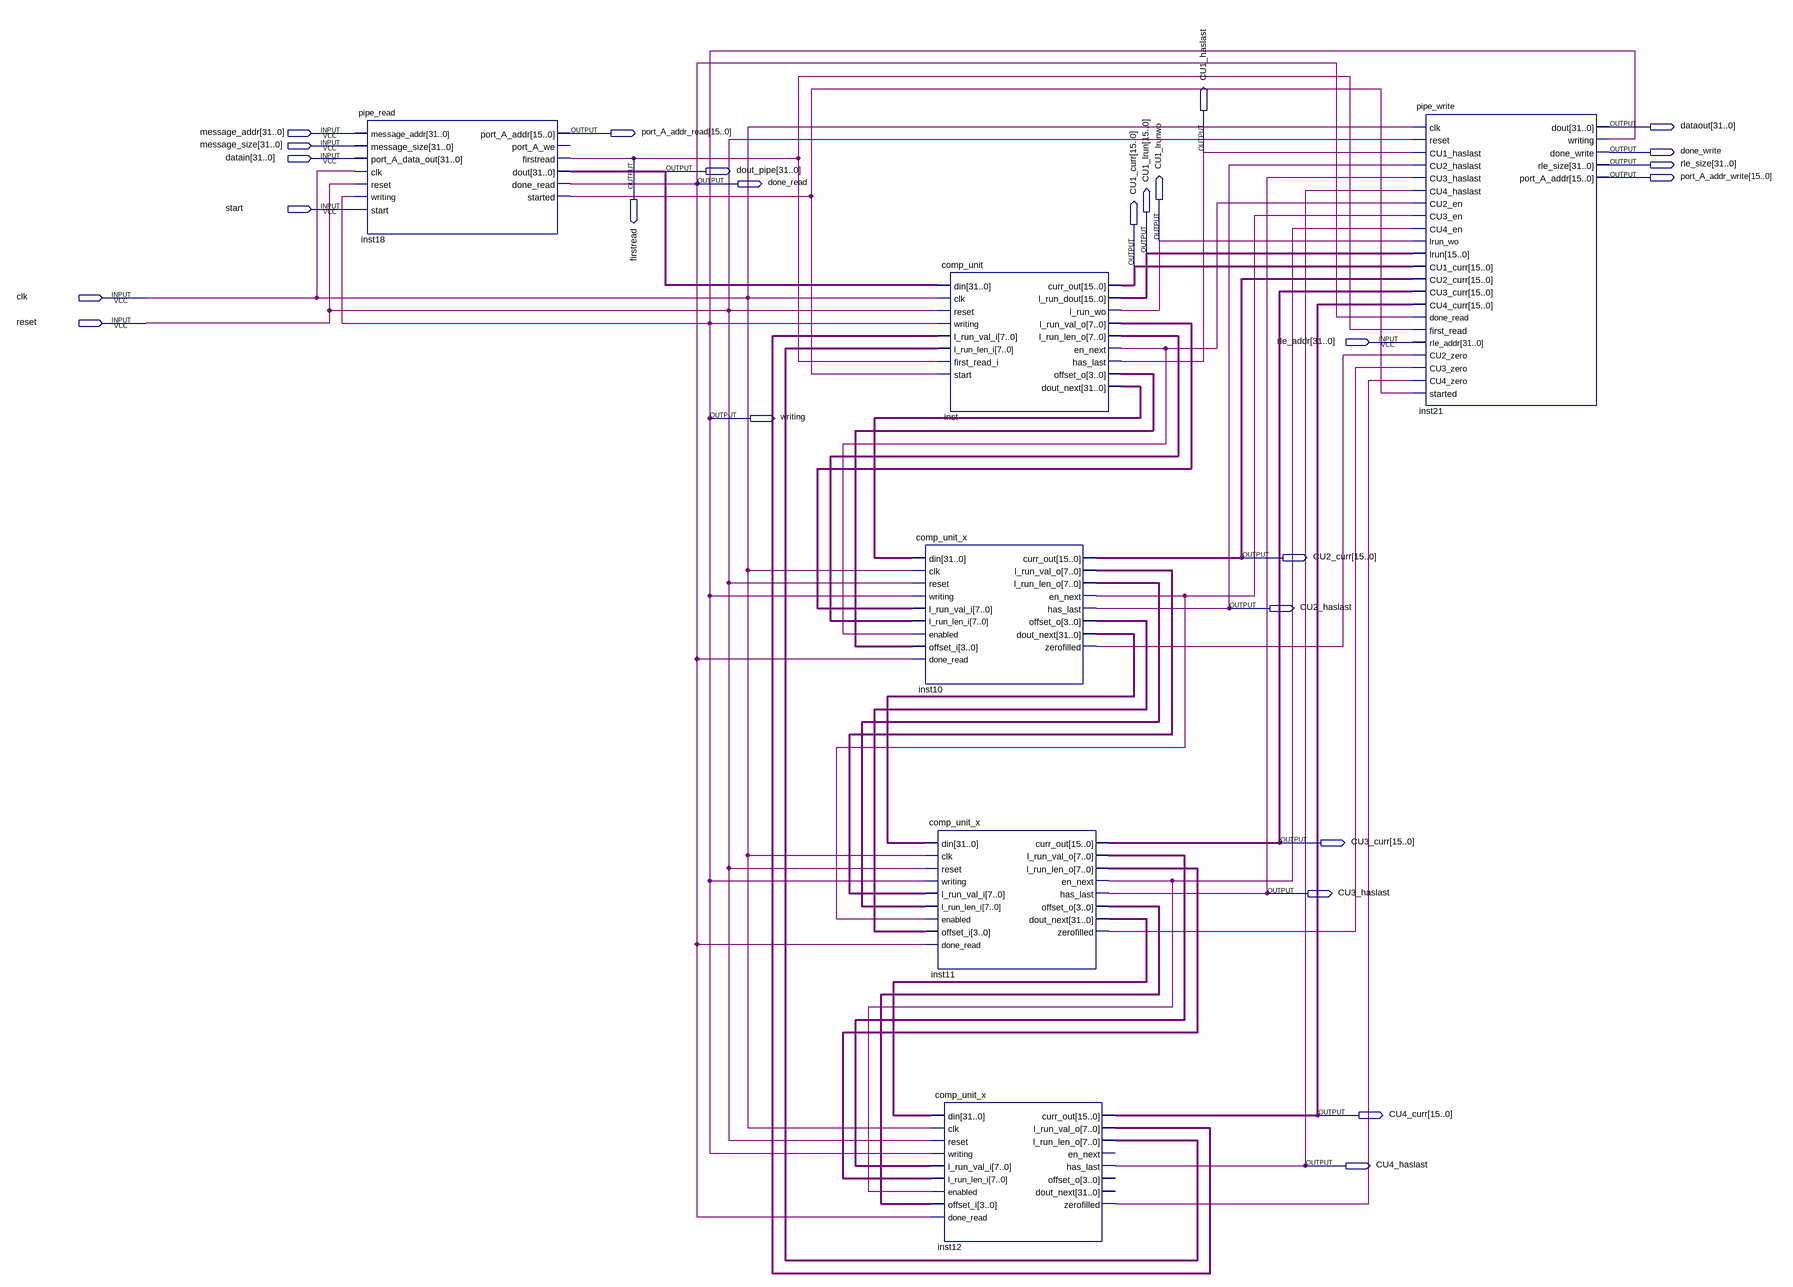
[diagram p0: schematic sheet]
// Quartus schematic block.bdf as structural Verilog: 6 symbols, 26 pins
module block (
  input  [31:0] message_addr,
  input  [31:0] message_size,
  input  [31:0] datain,
  input  start,
  input  clk,
  input  reset,
  input  [31:0] rle_addr,
  output [31:0] dataout,
  output [15:0] port_A_addr_read,
  output CU1_haslast,
  output done_write,
  output firstread,
  output [31:0] rle_size,
  output [31:0] dout_pipe,
  output [15:0] port_A_addr_write,
  output done_read,
  output CU1_lrunwo,
  output [15:0] CU1_lrun,
  output [15:0] CU1_curr,
  output writing,
  output [15:0] CU2_curr,
  output CU2_haslast,
  output [15:0] CU3_curr,
  output CU3_haslast,
  output [15:0] CU4_curr,
  output CU4_haslast
);

  wire inst10_en_next, inst10_zerofilled, inst11_en_next, inst11_zerofilled, inst12_zerofilled,
       inst18_started, inst_en_next;
  wire [3:0] inst10_offset_o, inst11_offset_o, inst_offset_o;
  wire [7:0] inst10_l_run_len_o, inst10_l_run_val_o, inst11_l_run_len_o, inst11_l_run_val_o,
       inst12_l_run_len_o, inst12_l_run_val_o, inst_l_run_len_o, inst_l_run_val_o;
  wire [31:0] inst10_dout_next, inst11_dout_next, inst_dout_next;

  pipe_read inst18 (
    .message_addr(message_addr), .message_size(message_size), .port_A_data_out(datain), .clk(clk),
    .reset(reset), .writing(writing), .start(start), .port_A_addr(port_A_addr_read), .firstread(firstread),
    .dout(dout_pipe), .done_read(done_read), .started(inst18_started));  // open: port_A_we
  comp_unit_x inst10 (
    .din(inst_dout_next), .clk(clk), .reset(reset), .writing(writing), .l_run_val_i(inst_l_run_val_o),
    .l_run_len_i(inst_l_run_len_o), .enabled(inst_en_next), .offset_i(inst_offset_o), .done_read(done_read),
    .curr_out(CU2_curr), .l_run_val_o(inst10_l_run_val_o), .l_run_len_o(inst10_l_run_len_o),
    .en_next(inst10_en_next), .has_last(CU2_haslast), .offset_o(inst10_offset_o),
    .dout_next(inst10_dout_next), .zerofilled(inst10_zerofilled));
  comp_unit_x inst11 (
    .din(inst10_dout_next), .clk(clk), .reset(reset), .writing(writing), .l_run_val_i(inst10_l_run_val_o),
    .l_run_len_i(inst10_l_run_len_o), .enabled(inst10_en_next), .offset_i(inst10_offset_o),
    .done_read(done_read), .curr_out(CU3_curr), .l_run_val_o(inst11_l_run_val_o),
    .l_run_len_o(inst11_l_run_len_o), .en_next(inst11_en_next), .has_last(CU3_haslast),
    .offset_o(inst11_offset_o), .dout_next(inst11_dout_next), .zerofilled(inst11_zerofilled));
  comp_unit_x inst12 (
    .din(inst11_dout_next), .clk(clk), .reset(reset), .writing(writing), .l_run_val_i(inst11_l_run_val_o),
    .l_run_len_i(inst11_l_run_len_o), .enabled(inst11_en_next), .offset_i(inst11_offset_o),
    .done_read(done_read), .curr_out(CU4_curr), .l_run_val_o(inst12_l_run_val_o),
    .l_run_len_o(inst12_l_run_len_o), .has_last(CU4_haslast), .zerofilled(inst12_zerofilled));  // open: en_next, offset_o, dout_next
  comp_unit inst (
    .din(dout_pipe), .clk(clk), .reset(reset), .writing(writing), .l_run_val_i(inst12_l_run_val_o),
    .l_run_len_i(inst12_l_run_len_o), .first_read_i(firstread), .start(inst18_started), .curr_out(CU1_curr),
    .l_run_dout(CU1_lrun), .l_run_wo(CU1_lrunwo), .l_run_val_o(inst_l_run_val_o),
    .l_run_len_o(inst_l_run_len_o), .en_next(inst_en_next), .has_last(CU1_haslast), .offset_o(inst_offset_o),
    .dout_next(inst_dout_next));
  pipe_write inst21 (
    .clk(clk), .reset(reset), .CU1_haslast(CU1_haslast), .CU2_haslast(CU2_haslast),
    .CU3_haslast(CU3_haslast), .CU4_haslast(CU4_haslast), .CU2_en(inst_en_next), .CU3_en(inst10_en_next),
    .CU4_en(inst11_en_next), .lrun_wo(CU1_lrunwo), .lrun(CU1_lrun), .CU1_curr(CU1_curr), .CU2_curr(CU2_curr),
    .CU3_curr(CU3_curr), .CU4_curr(CU4_curr), .done_read(done_read), .first_read(firstread),
    .rle_addr(rle_addr), .CU2_zero(inst10_zerofilled), .CU3_zero(inst11_zerofilled),
    .CU4_zero(inst12_zerofilled), .started(inst18_started), .dout(dataout), .writing(writing),
    .done_write(done_write), .rle_size(rle_size), .port_A_addr(port_A_addr_write));
endmodule
